# EasyEDA schematic SCH_macro-pad-schematic_2024-08-08.json
TITLE: Macro keyboard; REV: 1.0; Date: 2024-08-03; Sheet: 1/1; Company: LPP Le marais Sainte-therese
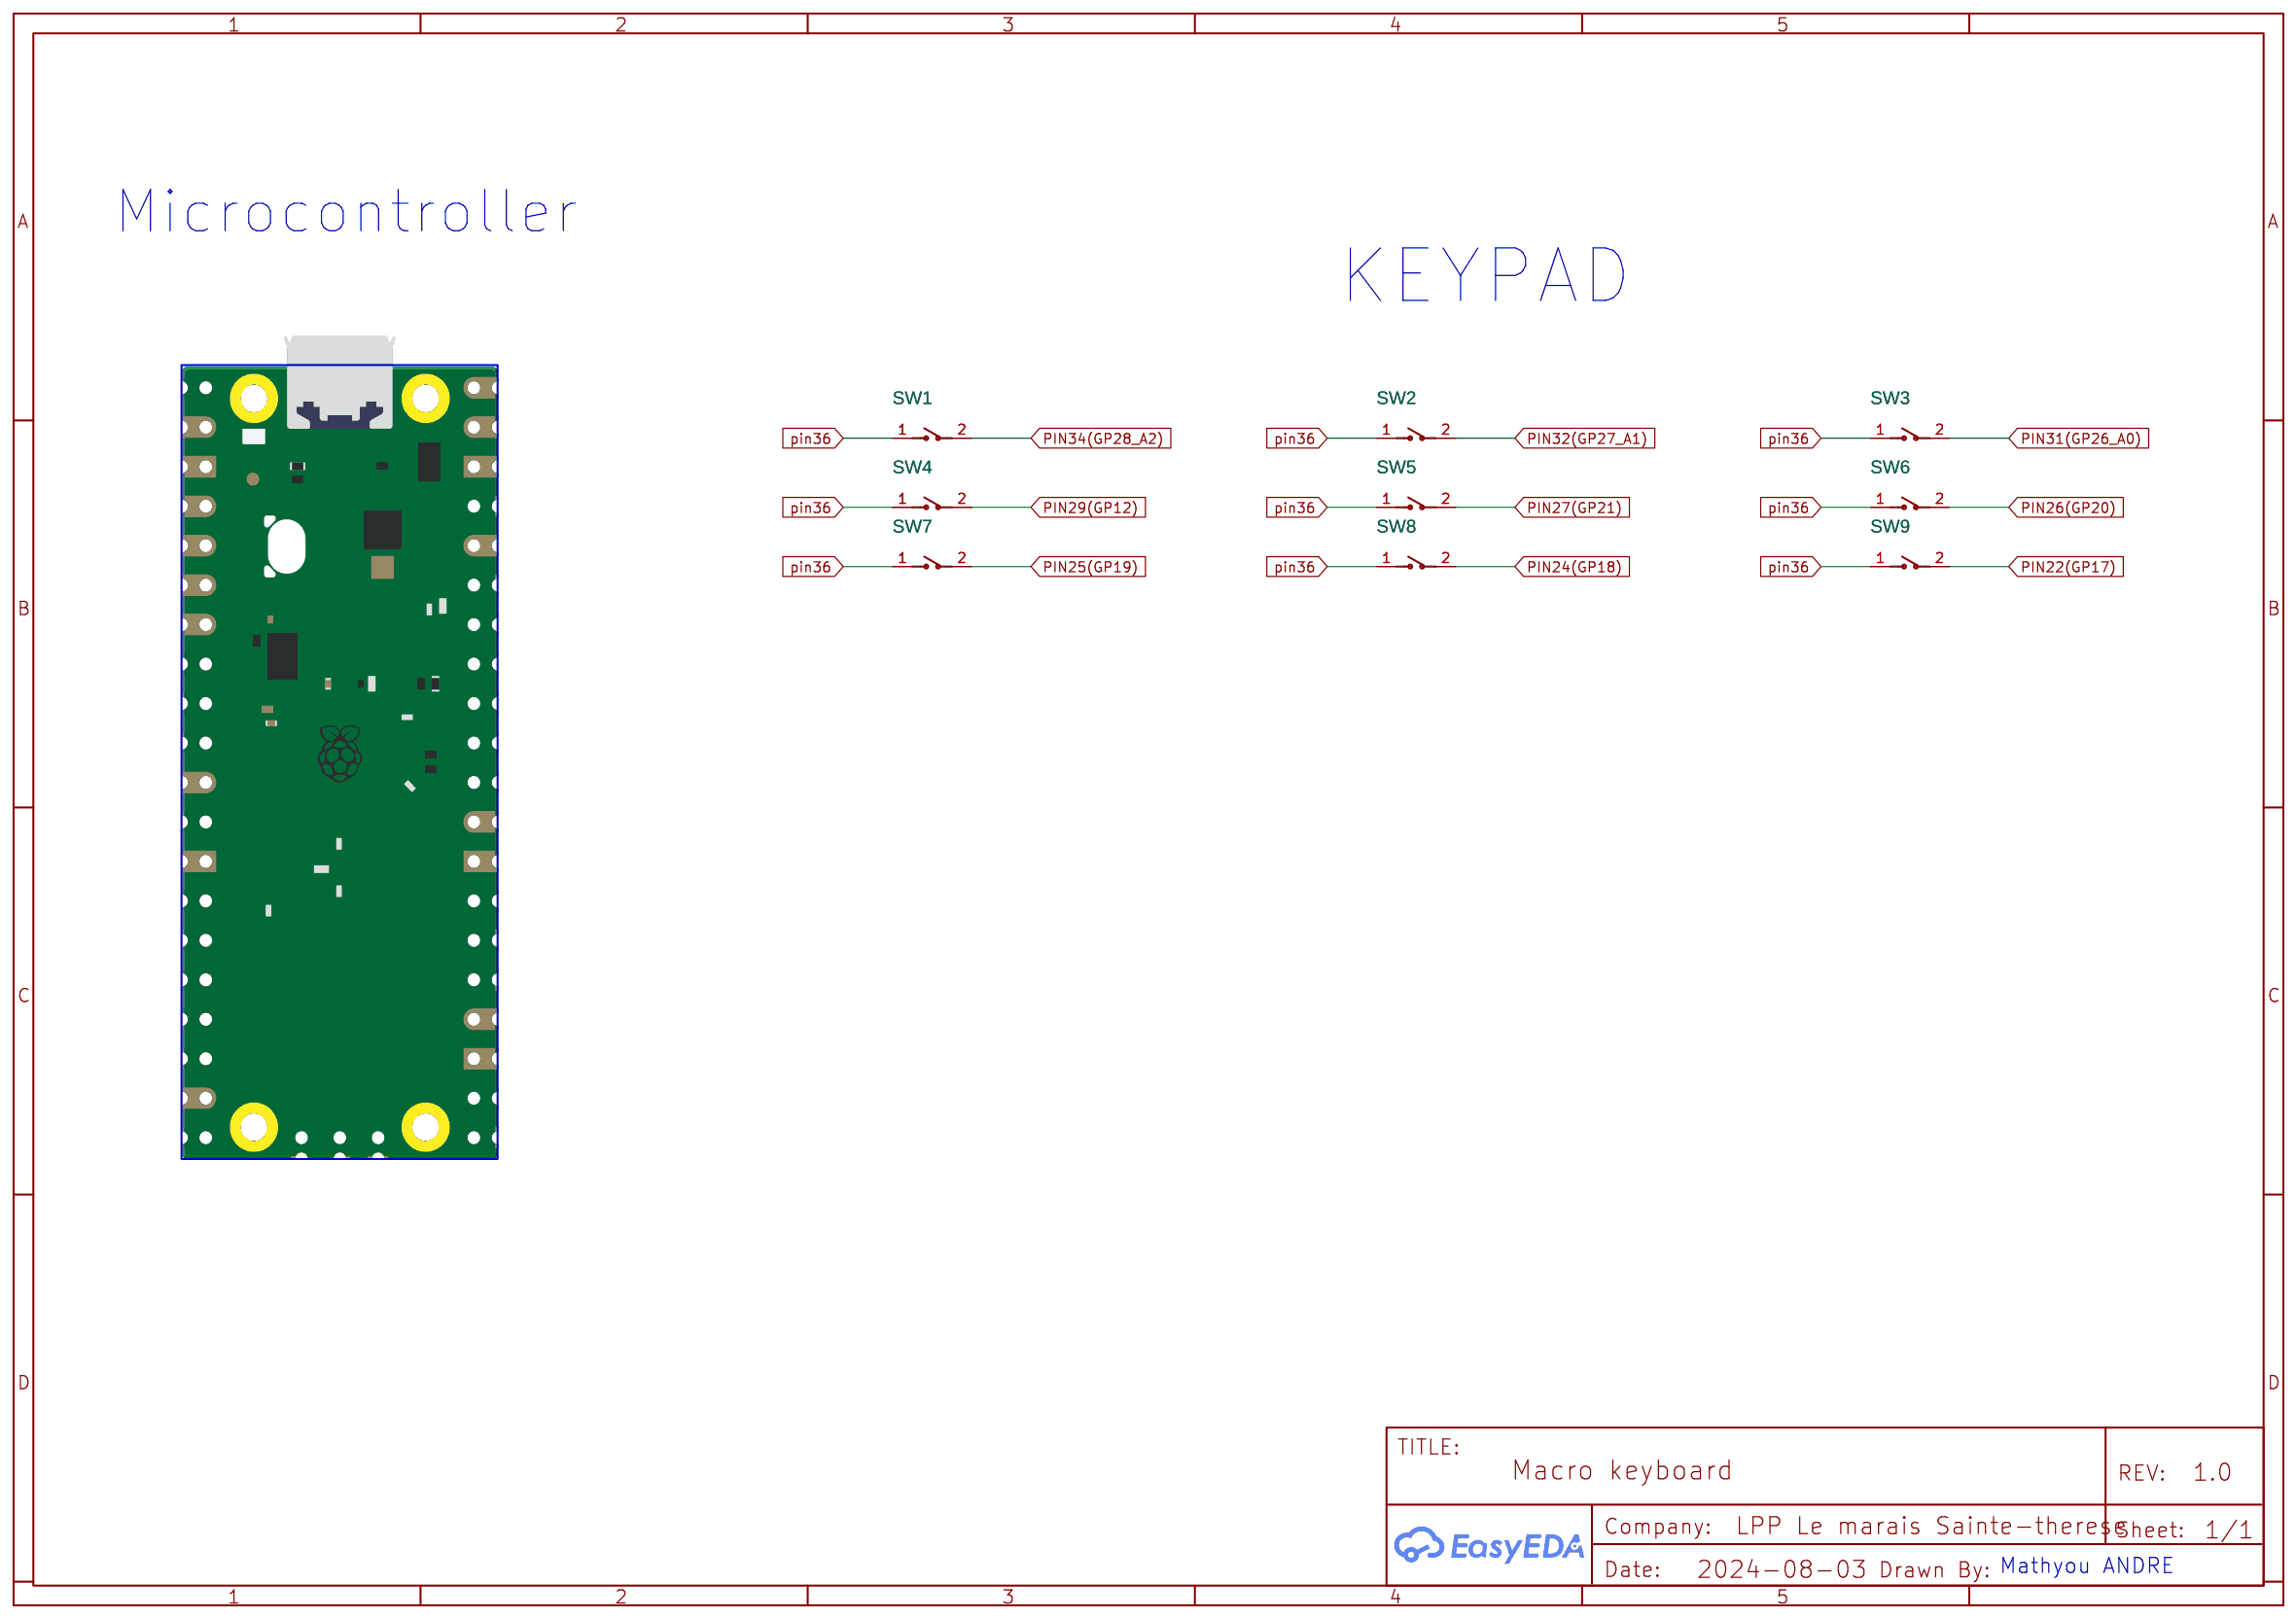
[diagram p0: schematic sheet]

## Parts
SW1  TS-3025-B-A-B  [SW-SMD_L3.0-W2.5-P3.40-LS4.0-L]
SW2  TS-3025-B-A-B  [SW-SMD_L3.0-W2.5-P3.40-LS4.0-L]
SW3  TS-3025-B-A-B  [SW-SMD_L3.0-W2.5-P3.40-LS4.0-L]
SW4  TS-3025-B-A-B  [SW-SMD_L3.0-W2.5-P3.40-LS4.0-L]
SW5  TS-3025-B-A-B  [SW-SMD_L3.0-W2.5-P3.40-LS4.0-L]
SW6  TS-3025-B-A-B  [SW-SMD_L3.0-W2.5-P3.40-LS4.0-L]
SW7  TS-3025-B-A-B  [SW-SMD_L3.0-W2.5-P3.40-LS4.0-L]
SW8  TS-3025-B-A-B  [SW-SMD_L3.0-W2.5-P3.40-LS4.0-L]
SW9  TS-3025-B-A-B  [SW-SMD_L3.0-W2.5-P3.40-LS4.0-L]

## Library data of the parts
SW1-SW9 = TS-3025-B-A-B: Contributor: LCSC; Supplier: LCSC; Supplier Part: C2885149; Manufacturer: XKB Connection(中国星坤); JLCPCB Part Class: Extended Part

## Nets
PIN22(GP17): SW9.2
PIN24(GP18): SW8.2
PIN25(GP19): SW7.2
PIN26(GP20): SW6.2
PIN27(GP21): SW5.2
PIN29(GP12): SW4.2
PIN31(GP26_A0): SW3.2
PIN32(GP27_A1): SW2.2
PIN34(GP28_A2): SW1.2
pin36: SW1.1 SW2.1 SW3.1 SW4.1 SW5.1 SW6.1 SW7.1 SW8.1 SW9.1

## Notes on the sheet
- Microcontroller
- KEYPAD
- Mathyou ANDRE
